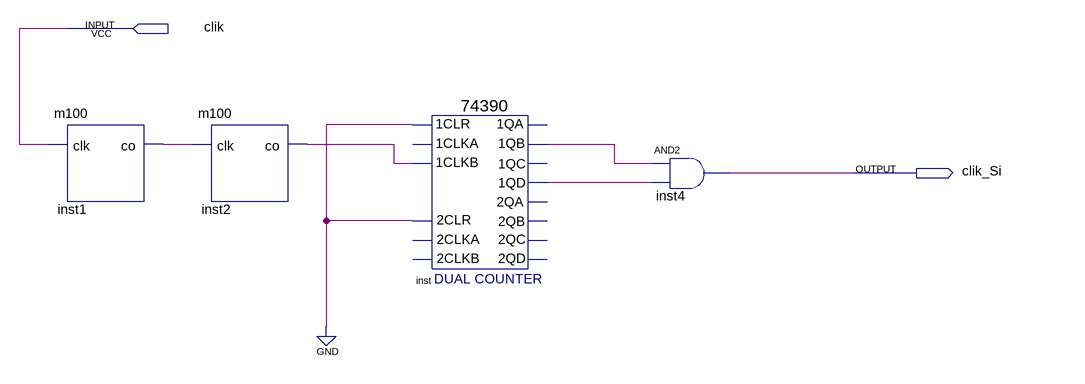
[diagram p0: schematic sheet]
// Quartus schematic do2.bdf as structural Verilog: 4 symbols, 2 pins
module do2 (
  input  clik,
  output clik_Si
);

  wire inst1_co, inst2_co, inst_1qb, inst_1qd;

  m100 inst1 (.clk(clik), .co(inst1_co));
  m100 inst2 (.clk(inst1_co), .co(inst2_co));
  \74390  inst (
    .\2CLR (1'b0), .\1CLR (1'b0), .\1CLKB (inst2_co), .\1QB (inst_1qb), .\1QD (inst_1qd));  // open: 2CLKA, 2CLKB, 1CLKA, 1QA, 1QC, 2QA, 2QB, 2QC, 2QD
  and inst4 (clik_Si, inst_1qb, inst_1qd);
endmodule
